# Altium schematic sheet Recepteur.SchDoc
size A4
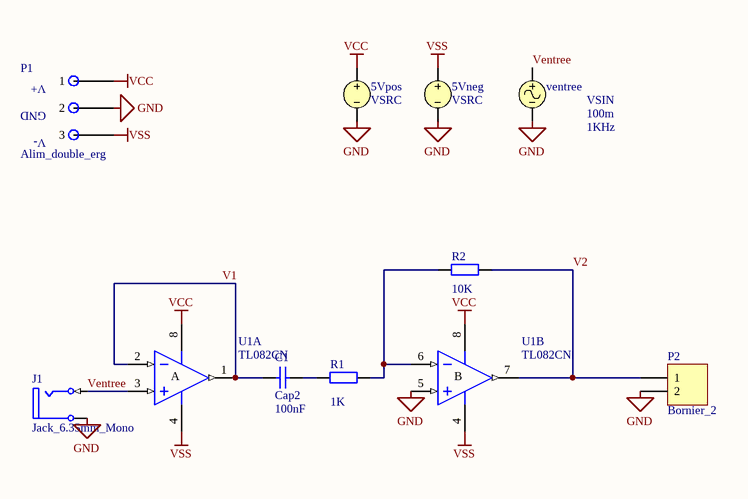
[diagram p0: Recepteur.SchDoc]

## Parts
5Vneg  VSRC
5Vpos  VSRC
C1  Cap2  value 100nF  [CAPA2]
J1  Jack_6.35mm_Mono  [Jack_6.5mm]
P1  Alim_double_erg  [Alim_double_erg]
P2  Bornier_2  [Bornier_2]
R1  value 1K  [res5_1/4W]  (hidden comment: Res2)
R2  value 10K  [res5_1/4W]  (hidden comment: Res2)
U1  TL082CN  [DIP8]  (parts A,B of 2)
ventree  VSIN  Amplitude: 100m  Frequency: 1KHz

## Nets
GND: 5Vneg.2 5Vpos.2 J1.2(S) P1.2 P2.2 U1.5(IN+) ventree.2
VCC: 5Vpos.1 P1.1 U1.8(V+)
VSS: 5Vneg.1 P1.3 U1.4(V-)
V1: C1.1 U1.1(OUT) U1.2(IN-)
V2: P2.1 R2.2 U1.7(OUT)
Ventree: J1.1(T) U1.3(IN+) ventree.1
NetC1_2: C1.2 R1.1
NetR1_2: R1.2 R2.1 U1.6(IN-)

## Notes on the sheet
- (in symbol Alim_double_erg) V+; GND; V-
- (in symbol TL082CN, part A) A
- (in symbol TL082CN, part B) B

## Library data of the parts
5Vneg = VSRC: Voltage Source; Note: PCB Footprint - Not required; Value: -5; Published: 8-Jun-2000; LatestRevisionDate: 17-Jul-2002; LatestRevisionNote: Re-released for DXP Platform.; PackageReference: Not Applicable; Publisher: Altium Limited
5Vpos = VSRC: Voltage Source; Note: PCB Footprint - Not required; Value: +5; Published: 8-Jun-2000; LatestRevisionDate: 17-Jul-2002; LatestRevisionNote: Re-released for DXP Platform.; PackageReference: Not Applicable; Publisher: Altium Limited
C1 = Cap2: Capacitor; Published: 8-Jun-2000; LatestRevisionDate: 17-Jul-2002; LatestRevisionNote: Re-released for DXP Platform.; PackageReference: RAD-0.3; Publisher: Altium Limited
J1 = Jack_6.35mm_Mono: Jack Socket, 1/4" [6.5mm], Thru-Hole, Vertical, 2-Conductor Open Circuit; PackageDocument: 2003; PCB_Layout: Complies with manufacturer's recommendation.; DrillAndSlotSize: Corresponds to nominal value.; LatestRevisionDate: 15-Jul-2004; LatestRevisionNote: Component Replaced.; DatasheetDocument: 2003; PackageReference: S1VS_SNS; Publisher: Altium Limited; ComponentLink1Description: Manufacturer Link; ComponentLink1URL: http://www.cliffuk.co.uk/
P1 = Alim_double_erg: 3-Pin; LatestRevisionDate: 17-Jul-2002; LatestRevisionNote: Re-released for DXP Platform.; Publisher: Altium Limited
P2 = Bornier_2: Header, 2-Pin; LatestRevisionDate: 17-Jul-2002; LatestRevisionNote: Re-released for DXP Platform.; Publisher: Altium Limited
R1 R2 = Res2: Resistor; Published: 8-Jun-2000; LatestRevisionDate: 17-Jul-2002; LatestRevisionNote: Re-released for DXP Platform.; PackageReference: AXIAL-0.4; Publisher: Altium Limited
U1 = TL082CN: General-Purpose J-FET Dual Operational Amplifier; Published: 24-Aug-2001; LatestRevisionDate: 06-Jun-2005; LatestRevisionNote: Stylized 3D Model Added.; DatasheetVersion: Jan-1999; PackageReference: DIP8; Publisher: Altium Limited; PackageDescription: DIP; 8 Leads; Row Spacing 7.62 mm; Pitch 2.54 mm; Code_JEDEC: MO-001-AN; ComponentLink1Description: Manufacturer Link; ComponentLink1URL: http://www.st.com/; ComponentLink2Description: Datasheet; ComponentLink2URL: http://www.st.com/stonline/products/literature/ds/2300/tl082.pdf
ventree = VSIN: Sinusoidal Voltage Source; Note: PCB Footprint - Not required; Published: 8-Jun-2000; LatestRevisionDate: 15-Nov-2004; LatestRevisionNote: Corrected Netlist.; PackageReference: Not Applicable; Publisher: Altium Limited